# Altium schematic sheet eVV_Sensors.SchDoc: eVV_Sensors
size A4; DrawnBy: Ivica Matovic; Revision: 1.1; SheetNumber: 8; SheetTotal: 8
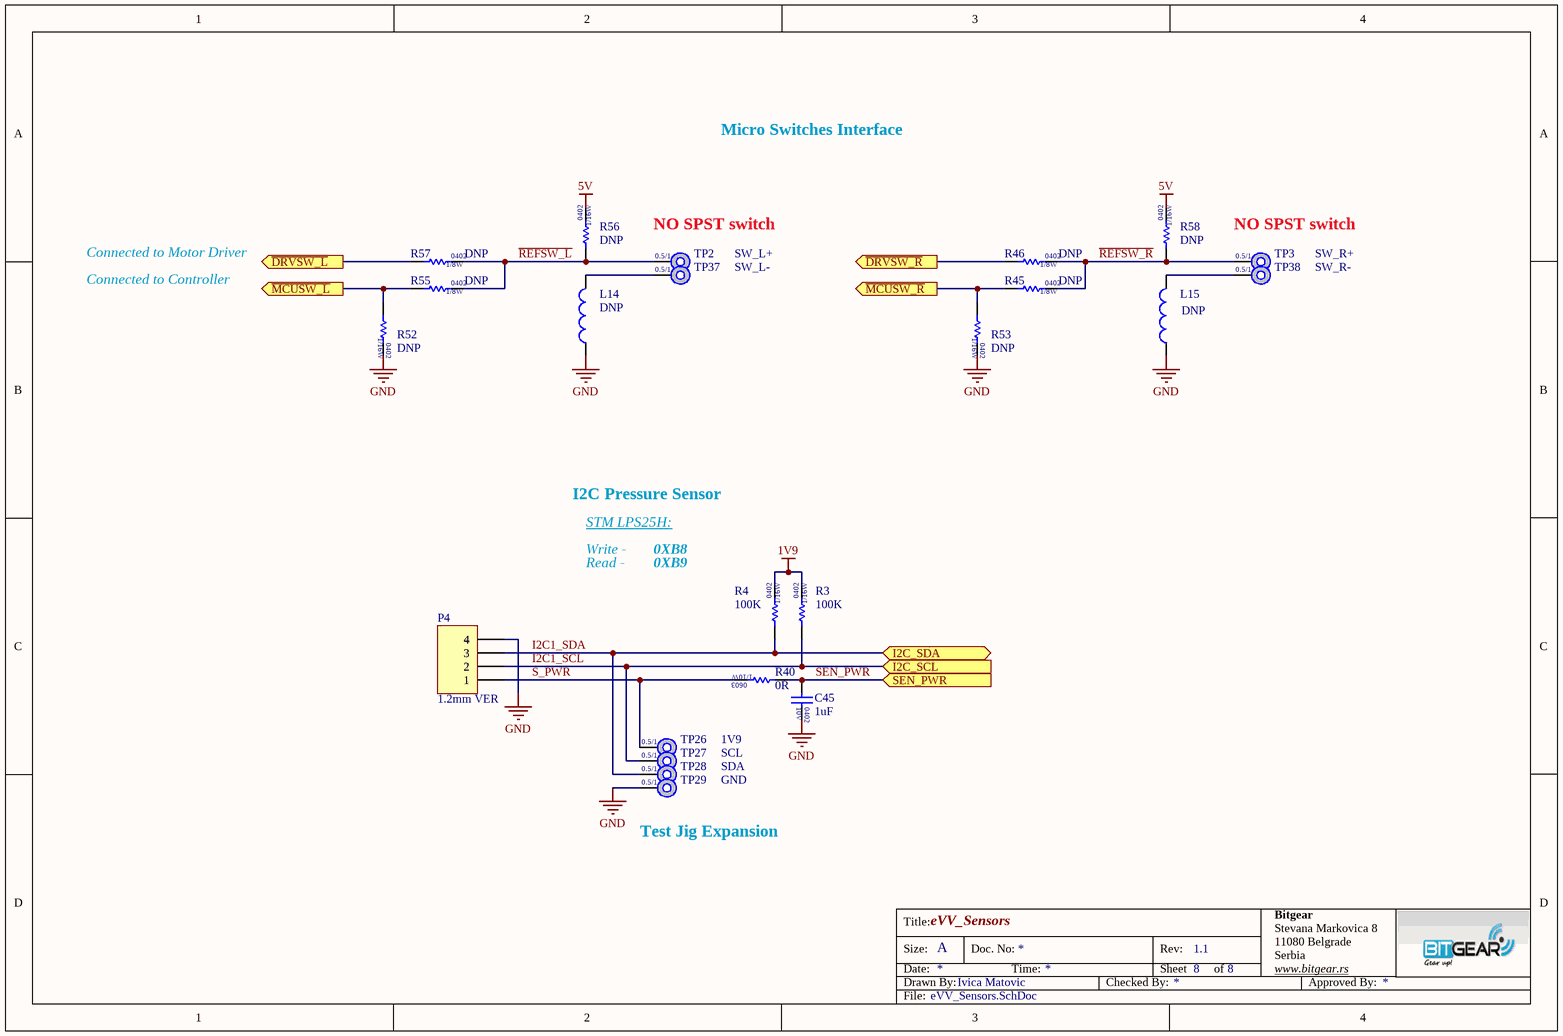
[diagram p0: eVV_Sensors.SchDoc]

## Parts
C45  1uF  [CAPC1005X60N]
L14  DNP  [INDC1005X60N]
L15  DNP  [INDC1005X60N]
P4  1.2mm VER  [MOLEX_0781710004]
R3  100K  [RESC1005X40AN]
R4  100K  [RESC1005X40AN]
R40  0R  [RESC1608X84N]
R45  DNP  [RESC1005X40AN]
R46  DNP  [RESC1005X40AN]
R52  DNP  [RESC1005X40AN]
R53  DNP  [RESC1005X40AN]
R55  DNP  [RESC1005X40AN]
R56  DNP  [RESC1005X40AN]
R57  DNP  [RESC1005X40AN]
R58  DNP  [RESC1005X40AN]
TP2  SW_L+  [TEST_POINT_TH_1MM]  (no BOM)
TP3  SW_R+  [TEST_POINT_TH_1MM]  (no BOM)
TP26  1V9  [TEST_POINT_TH_1MM]  (no BOM)
TP27  SCL  [TEST_POINT_TH_1MM]  (no BOM)
TP28  SDA  [TEST_POINT_TH_1MM]  (no BOM)
TP29  GND  [TEST_POINT_TH_1MM]  (no BOM)
TP37  SW_L-  [TEST_POINT_TH_1MM]  (no BOM)
TP38  SW_R-  [TEST_POINT_TH_1MM]  (no BOM)

## Ports
I2C_SCL (in), I2C_SDA (bidir), SEN_PWR (in), ~{DRVSW_L} (out), ~{DRVSW_R} (out), ~{MCUSW_L} (out), ~{MCUSW_R} (out)

## Nets
1V9: R3.1 R4.1
5V: R56.1 R58.1
GND: C45.2 L14.1 L15.1 P4.4 R52.1 R53.1 TP29.1
~{DRVSW_L}: R57.2 ; port ~{DRVSW_L}
~{DRVSW_R}: R46.2 ; port ~{DRVSW_R}
~{MCUSW_L}: R52.2 R55.2 ; port ~{MCUSW_L}
~{MCUSW_R}: R45.2 R53.2 ; port ~{MCUSW_R}
~{REFSW_L}: R55.1 R56.2 R57.1 TP2.1
~{REFSW_R}: R45.1 R46.1 R58.2 TP3.1
I2C1_SCL: P4.2 R3.2 TP27.1 ; port I2C_SCL
I2C1_SDA: P4.3 R4.2 TP28.1 ; port I2C_SDA
S_PWR: P4.1 R40.1 TP26.1
SEN_PWR: C45.1 R40.2 ; port SEN_PWR
NetL14_2: L14.2 TP37.1
NetL15_2: L15.2 TP38.1

## Notes on the sheet
- Micro Switches Interface
- NO SPST switch
- Connected to Motor Driver
- Connected to Controller
- I2C Pressure Sensor
- STM LPS25H:
- Write -
- Read -
- 0XB8
- 0XB9
- Test Jig Expansion
- Title:
- Bitgear
- Size:
- Date:
- Drawn By:
- A
- Doc. No:
- Time:
- Checked By:
- Sheet
- Rev:
- of
- Stevana Markovica 8
- 11080 Belgrade
- Serbia
- www.bitgear.rs
- Approved By:
- File:
- (in symbol Cap-1005 (0402) CER 1uF 10V X5R 10%) 10V
- (in symbol Res-1005 (0402) 22 Ohm 1/8W 1%) 0402; 1/8W
- (in symbol Res-1005 (0402) 49.9 KOhm 1/16W 1%) 1/16W; 0402
- (in symbol Res-1005 (0402) 100 KOhm 1/16W 1%) 0402; 1/16W
- (in symbol Res-1608 (0603) 0 Ohm 1/10W) 1/10W; 0603
- (in symbol TP TH) 0.5/1

## Library data of the parts
C45 = Cap-1005 (0402) CER 1uF 10V X5R 10%: Manufacturer: Murata Electronics North America; D P/N: 490-3890-1-ND; D Price: 0.18; M P/N: GRM155R61A105KE15D; S MOQ: 10000; S P/N: 490-3890-2-ND; S Price: 0.01323; Distributor: Digikey; Mounting: SMD; Supplier: Digi Key; Package: 0402; Value: 1uF
L14 L15 = FBead-1005 (0402) 220 Ohm 800mA: FERRITE BEAD 220 Ohm 800mA 0402; Manufacturer: Taiyo Yuden; D P/N: 587-2088-1-ND; D Price: 0.1; M P/N: BKP1005HS221-T; S MOQ: 10000; S P/N: 587-2088-2-ND; S Price: 0.01503; Value: 220Ohm; Distributor: Digikey; Mounting: SM; Supplier: Digi Key
P4 = Connector MOLEX Pico-EZmate 1X4 1.2mm: 1.2mm pitch Pico-EZmate, Wire to Board, Vertical, with Locks, 1X4; Manufacturer: Molex; D P/N: WM4460CT-ND; D Price: 0.66; M P/N: 078171-0004; S MOQ: 1000; S Price: 0.34; Distributor: Digikey; Mounting: SMD; S P/N: WM4460CT-ND; Supplier: Digi Key; Value: 1X4
R3 R4 = Res-1005 (0402) 100 KOhm 1/16W 1%: Manufacturer: Vishay Dale; D P/N: 311-100KLRCT-ND; D Price: 0.1; M P/N: RC0402FR-07100KL; S MOQ: 10000; S P/N: 311-100KLRTR-ND; S Price: 0.00152; Distributor: Digikey; Mounting: SM; Supplier: Digi Key; Value: 100K
R40 = Res-1608 (0603) 0 Ohm 1/10W: Manufacturer: Samsung Electro-Mechanics America; D P/N: 1276-3510-1-ND; D Price: 0.1; M P/N: RC1608J000CS; S MOQ: 5000; S P/N: 1276-3510-2-ND; S Price: 0.00078; Distributor: Digikey; Mounting: SM; Supplier: Digi Key; Value: 0R
R45 R46 R55 R57 = Res-1005 (0402) 22 Ohm 1/8W 1%: Manufacturer: Vishay Dale; D P/N: 541-22.0YCT-ND; D Price: 0.020; M P/N: CRCW040222R0FKEDHP; S MOQ: 10000; S P/N: 541-22.0YTR-ND; S Price: 0.02376; Value: 22R; Distributor: Digikey; Mounting: SM; Supplier: Digi Key
R52 R53 = Res-1005 (0402) 49.9 KOhm 1/16W 1%: Manufacturer: Yageo; D P/N: 311-49.9KLRCT-ND; D Price: 0.1; M P/N: RC0402FR-0749K9L; S MOQ: 10000; S P/N: 311-49.9KLRTR-ND; S Price: 0.00152; Value: 49.9K; Distributor: Digikey; Mounting: SM; Supplier: Digi Key
R56 R58 = Res-1005 (0402) 100 KOhm 1/16W 1%: Manufacturer: Vishay Dale; D P/N: 311-100KLRCT-ND; D Price: 0.1; M P/N: RC0402FR-07100KL; S MOQ: 10000; S P/N: 311-100KLRTR-ND; S Price: 0.00152; Value: 100K; Distributor: Digikey; Mounting: SM; Supplier: Digi Key
TP2 TP3 TP26-TP29 TP37 TP38 = TP TH: Test point Through Hole; D P/N: TESTP; D Price: 0; M P/N: TESTP; Mounting: SM